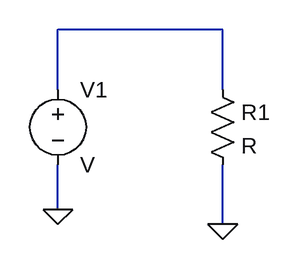
[diagram p0: schematic Draft2.asc]
Draft2.asc, the LTspice schematic file:
Version 4
SHEET 1 880 680
WIRE 288 48 112 48
WIRE 112 112 112 48
WIRE 288 112 288 48
WIRE 112 240 112 192
WIRE 288 256 288 192
FLAG 112 240 0
FLAG 288 256 0
SYMBOL voltage 112 96 R0
SYMATTR InstName V1
SYMBOL res 272 96 R0
SYMATTR InstName R1

The netlist it stands for:
* Draft2.asc
V1 N001 0 V
R1 N001 0 R
.backanno
.end